# Altium schematic sheet main.SchDoc
size A4; SheetNumber: 1; SheetTotal: 7
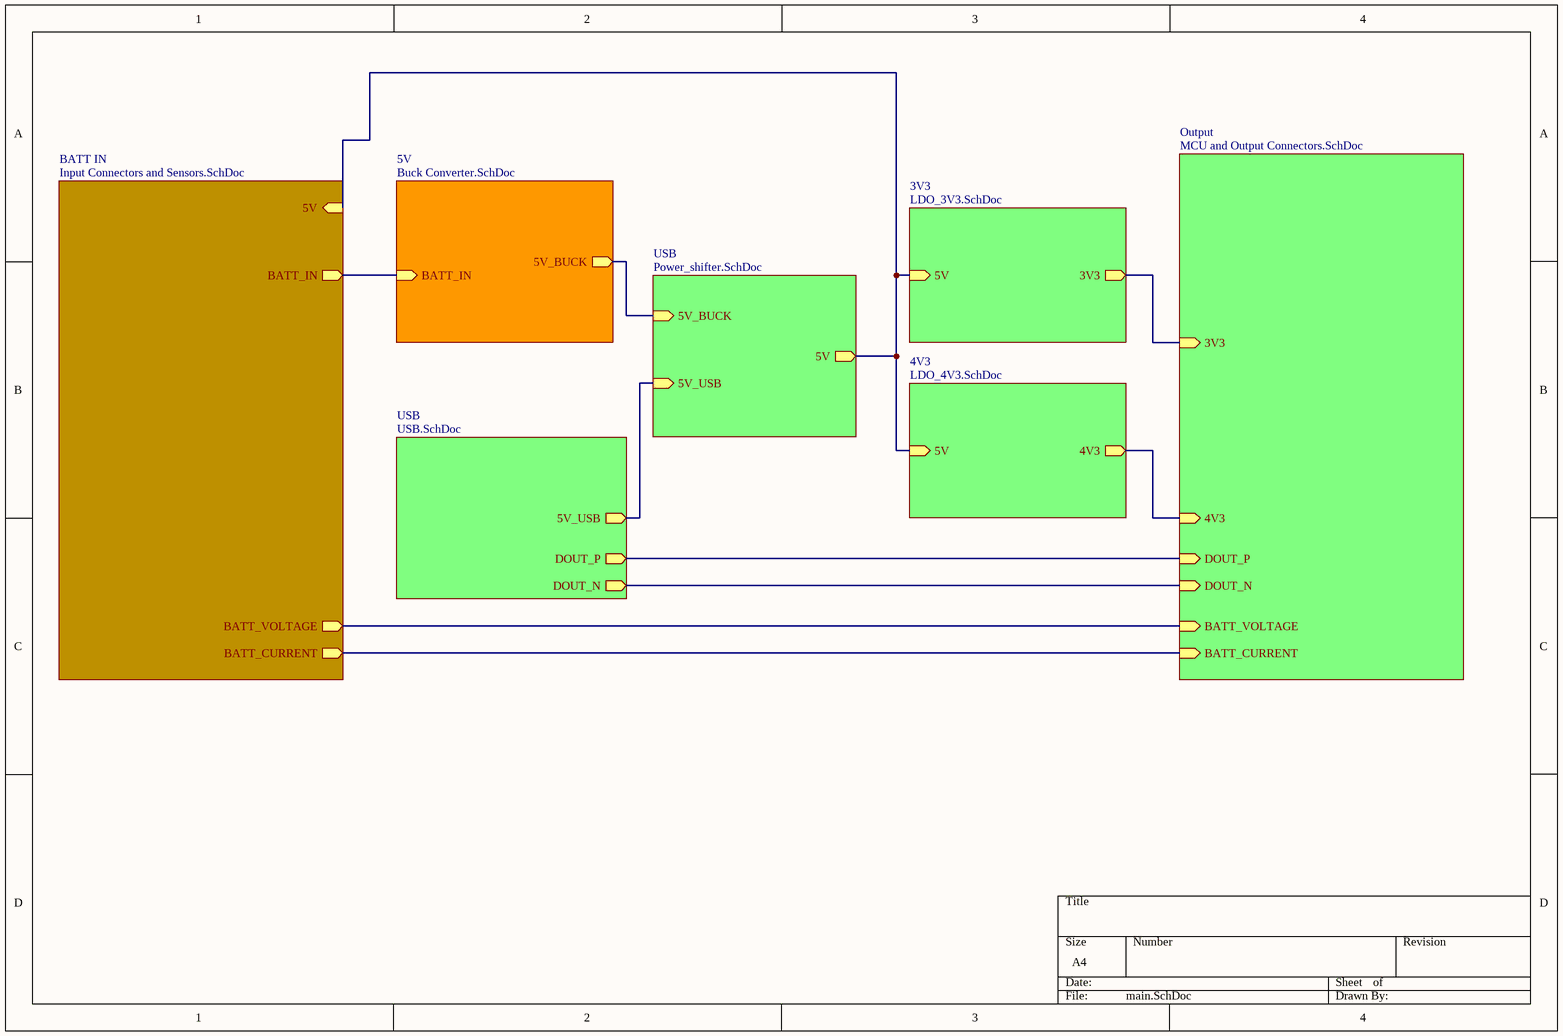
[diagram p0: main.SchDoc]

## Sub-sheets
3V3 = LDO_3V3.SchDoc: 5V (in), 3V3 (out)
4V3 = LDO_4V3.SchDoc: 5V (in), 4V3 (out)
5V = Buck Converter.SchDoc: BATT_IN (in), 5V_BUCK (out)
BATT IN = Input Connectors and Sensors.SchDoc: BATT_IN (out), 5V (in), BATT_CURRENT (out), BATT_VOLTAGE (out)
Output = MCU and Output Connectors.SchDoc: 3V3 (in), 4V3 (in), BATT_CURRENT (in), BATT_VOLTAGE (in), DOUT_P (in), DOUT_N (in)
USB = USB.SchDoc: 5V_USB (out), DOUT_P (out), DOUT_N (out)
USB = Power_shifter.SchDoc: 5V_USB (in), 5V_BUCK (in), 5V (out)

## Nets
(unnamed): sheet BATT IN/BATT_IN, sheet 5V/BATT_IN
(unnamed): sheet BATT IN/5V, sheet 3V3/5V, sheet 4V3/5V, sheet USB/5V
(unnamed): sheet BATT IN/BATT_CURRENT, sheet Output/BATT_CURRENT
(unnamed): sheet BATT IN/BATT_VOLTAGE, sheet Output/BATT_VOLTAGE
(unnamed): sheet 5V/5V_BUCK, sheet USB/5V_BUCK
(unnamed): sheet 3V3/3V3, sheet Output/3V3
(unnamed): sheet Output/4V3, sheet 4V3/4V3
(unnamed): sheet Output/DOUT_P, sheet USB/DOUT_P
(unnamed): sheet Output/DOUT_N, sheet USB/DOUT_N
(unnamed): sheet USB/5V_USB, sheet USB/5V_USB